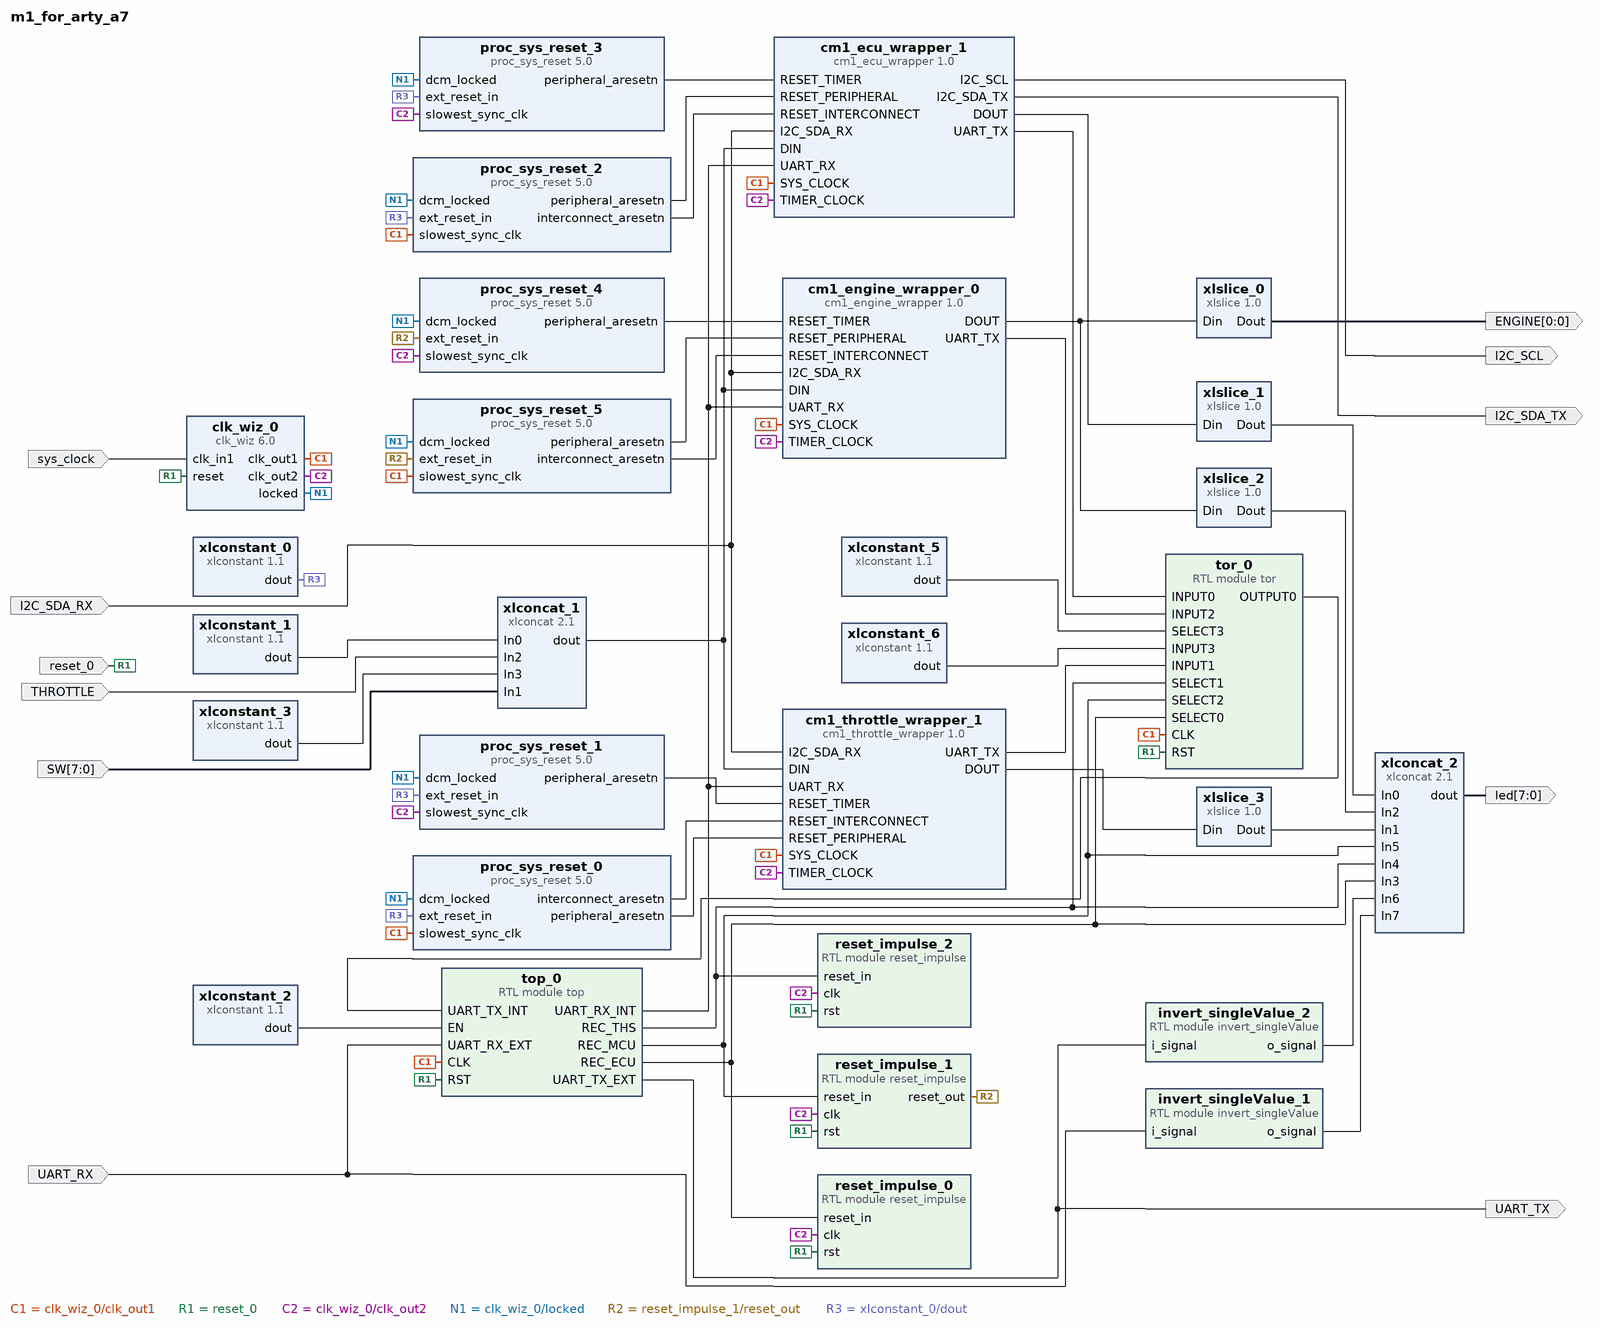
[diagram p0: block diagram of the top level]
# Vivado block design m1_for_arty_a7, xc7z020clg484-1, Vivado 2018.3
create_bd_design m1_for_arty_a7

create_bd_port -dir I -type rst reset_0
set_property -dict {CONFIG.POLARITY ACTIVE_HIGH} [get_bd_ports reset_0]
create_bd_port -dir I UART_RX
create_bd_port -dir I -type clk sys_clock
set_property -dict {CONFIG.FREQ_HZ 100000000 CONFIG.PHASE 0.000} [get_bd_ports sys_clock]
create_bd_port -dir O UART_TX
create_bd_port -dir I I2C_SDA_RX
create_bd_port -dir I THROTTLE
create_bd_port -dir O -from 7 -to 0 led
create_bd_port -dir O I2C_SDA_TX
create_bd_port -dir O I2C_SCL
create_bd_port -dir O -from 0 -to 0 ENGINE
create_bd_port -dir I -from 7 -to 0 SW

create_bd_cell -type ip -vlnv xilinx.com:ip:clk_wiz:6.0 clk_wiz_0
set_property -dict [list \
  CONFIG.CLKOUT1_JITTER 130.958 \
  CONFIG.CLKOUT1_REQUESTED_OUT_FREQ 100 \
  CONFIG.CLKOUT2_JITTER 218.754 \
  CONFIG.CLKOUT2_PHASE_ERROR 98.575 \
  CONFIG.CLKOUT2_REQUESTED_OUT_FREQ 8.000 \
  CONFIG.CLKOUT2_USED true \
  CONFIG.CLK_IN1_BOARD_INTERFACE sys_clock \
  CONFIG.MMCM_CLKOUT0_DIVIDE_F 10.000 \
  CONFIG.MMCM_CLKOUT1_DIVIDE 125 \
  CONFIG.MMCM_DIVCLK_DIVIDE 1 \
  CONFIG.NUM_OUT_CLKS 2 \
  CONFIG.USE_RESET true \
] [get_bd_cells clk_wiz_0]
create_bd_cell -type ip -vlnv xilinx.com:ip:proc_sys_reset:5.0 proc_sys_reset_0
set_property -dict {CONFIG.C_EXT_RST_WIDTH 1} [get_bd_cells proc_sys_reset_0]
create_bd_cell -type ip -vlnv xilinx.com:ip:proc_sys_reset:5.0 proc_sys_reset_1
set_property -dict {CONFIG.C_EXT_RST_WIDTH 1} [get_bd_cells proc_sys_reset_1]
create_bd_cell -type ip -vlnv xilinx.com:ip:xlconstant:1.1 xlconstant_2
set_property -dict {CONFIG.CONST_VAL 1 CONFIG.CONST_WIDTH 1} [get_bd_cells xlconstant_2]
create_bd_cell -type ip -vlnv xilinx.com:ip:xlconcat:2.1 xlconcat_1
set_property -dict [list \
  CONFIG.IN0_WIDTH 8 \
  CONFIG.IN1_WIDTH 8 \
  CONFIG.IN2_WIDTH 1 \
  CONFIG.IN3_WIDTH 15 \
  CONFIG.NUM_PORTS 4 \
] [get_bd_cells xlconcat_1]
create_bd_cell -type ip -vlnv xilinx.com:ip:xlconstant:1.1 xlconstant_1
set_property -dict {CONFIG.CONST_WIDTH 8} [get_bd_cells xlconstant_1]
create_bd_cell -type ip -vlnv xilinx.com:ip:xlslice:1.0 xlslice_0
set_property -dict {CONFIG.DIN_FROM 1 CONFIG.DIN_TO 1 CONFIG.DOUT_WIDTH 1} [get_bd_cells xlslice_0]
create_bd_cell -type ip -vlnv xilinx.com:ip:xlslice:1.0 xlslice_1
set_property -dict {CONFIG.DIN_FROM 0 CONFIG.DOUT_WIDTH 1} [get_bd_cells xlslice_1]
create_bd_cell -type ip -vlnv xilinx.com:ip:xlconstant:1.1 xlconstant_3
set_property -dict {CONFIG.CONST_WIDTH 15} [get_bd_cells xlconstant_3]
create_bd_cell -type ip -vlnv xilinx.com:ip:xlslice:1.0 xlslice_2
set_property -dict {CONFIG.DIN_FROM 0 CONFIG.DOUT_WIDTH 1} [get_bd_cells xlslice_2]
create_bd_cell -type ip -vlnv xilinx.com:ip:xlconcat:2.1 xlconcat_2
set_property -dict {CONFIG.IN0_WIDTH 1 CONFIG.NUM_PORTS 8} [get_bd_cells xlconcat_2]
create_bd_cell -type ip -vlnv xilinx.com:ip:xlslice:1.0 xlslice_3
set_property -dict {CONFIG.DIN_FROM 0 CONFIG.DOUT_WIDTH 1} [get_bd_cells xlslice_3]
create_bd_cell -type ip -vlnv xilinx.com:ip:xlconstant:1.1 xlconstant_5
set_property -dict {CONFIG.CONST_VAL 0 CONFIG.CONST_WIDTH 1} [get_bd_cells xlconstant_5]
create_bd_cell -type ip -vlnv xilinx.com:ip:proc_sys_reset:5.0 proc_sys_reset_2
set_property -dict {CONFIG.C_EXT_RST_WIDTH 1} [get_bd_cells proc_sys_reset_2]
create_bd_cell -type ip -vlnv xilinx.com:ip:proc_sys_reset:5.0 proc_sys_reset_3
set_property -dict {CONFIG.C_EXT_RST_WIDTH 1} [get_bd_cells proc_sys_reset_3]
create_bd_cell -type ip -vlnv xilinx.com:ip:proc_sys_reset:5.0 proc_sys_reset_4
set_property -dict {CONFIG.C_EXT_RST_WIDTH 1} [get_bd_cells proc_sys_reset_4]
create_bd_cell -type ip -vlnv xilinx.com:ip:proc_sys_reset:5.0 proc_sys_reset_5
set_property -dict {CONFIG.C_EXT_RST_WIDTH 1} [get_bd_cells proc_sys_reset_5]
create_bd_cell -type ip -vlnv xilinx.com:ip:xlconstant:1.1 xlconstant_6
set_property -dict {CONFIG.CONST_VAL 0 CONFIG.CONST_WIDTH 1} [get_bd_cells xlconstant_6]
create_bd_cell -type module -reference reset_impulse reset_impulse_0
create_bd_cell -type module -reference reset_impulse reset_impulse_1
create_bd_cell -type module -reference reset_impulse reset_impulse_2
create_bd_cell -type module -reference top top_0
create_bd_cell -type module -reference invert_singleValue invert_singleValue_1
create_bd_cell -type module -reference invert_singleValue invert_singleValue_2
create_bd_cell -type module -reference tor tor_0
create_bd_cell -type ip -vlnv user.org:user:cm1_ecu_wrapper:1.0 cm1_ecu_wrapper_1
create_bd_cell -type ip -vlnv user.org:user:cm1_engine_wrapper:1.0 cm1_engine_wrapper_0
create_bd_cell -type ip -vlnv user.org:user:cm1_throttle_wrapper:1.0 cm1_throttle_wrapper_1
create_bd_cell -type ip -vlnv xilinx.com:ip:xlconstant:1.1 xlconstant_0

# ---- connections ----

connect_bd_net [get_bd_pins clk_wiz_0/clk_out1] \
  [get_bd_pins proc_sys_reset_0/slowest_sync_clk] [get_bd_pins proc_sys_reset_5/slowest_sync_clk] \
  [get_bd_pins proc_sys_reset_2/slowest_sync_clk] [get_bd_pins top_0/CLK] [get_bd_pins tor_0/CLK] \
  [get_bd_pins cm1_throttle_wrapper_1/SYS_CLOCK] [get_bd_pins cm1_engine_wrapper_0/SYS_CLOCK] \
  [get_bd_pins cm1_ecu_wrapper_1/SYS_CLOCK]
connect_bd_net -net reset_0_1 [get_bd_pins proc_sys_reset_1/peripheral_aresetn] [get_bd_pins cm1_throttle_wrapper_1/RESET_TIMER]
connect_bd_net -net reset_0_2 [get_bd_ports reset_0] \
  [get_bd_pins clk_wiz_0/reset] [get_bd_pins reset_impulse_0/rst] [get_bd_pins reset_impulse_1/rst] \
  [get_bd_pins reset_impulse_2/rst] [get_bd_pins top_0/RST] [get_bd_pins tor_0/RST]
connect_bd_net -net M04_ACLK_1 [get_bd_pins clk_wiz_0/clk_out2] \
  [get_bd_pins proc_sys_reset_1/slowest_sync_clk] [get_bd_pins proc_sys_reset_4/slowest_sync_clk] \
  [get_bd_pins proc_sys_reset_3/slowest_sync_clk] [get_bd_pins reset_impulse_0/clk] [get_bd_pins reset_impulse_1/clk] \
  [get_bd_pins reset_impulse_2/clk] [get_bd_pins cm1_throttle_wrapper_1/TIMER_CLOCK] \
  [get_bd_pins cm1_engine_wrapper_0/TIMER_CLOCK] [get_bd_pins cm1_ecu_wrapper_1/TIMER_CLOCK]
connect_bd_net [get_bd_ports sys_clock] [get_bd_pins clk_wiz_0/clk_in1]
connect_bd_net [get_bd_pins clk_wiz_0/locked] \
  [get_bd_pins proc_sys_reset_0/dcm_locked] [get_bd_pins proc_sys_reset_1/dcm_locked] \
  [get_bd_pins proc_sys_reset_4/dcm_locked] [get_bd_pins proc_sys_reset_5/dcm_locked] \
  [get_bd_pins proc_sys_reset_3/dcm_locked] [get_bd_pins proc_sys_reset_2/dcm_locked]
connect_bd_net [get_bd_pins xlslice_0/Dout] [get_bd_ports ENGINE]
connect_bd_net [get_bd_pins xlconstant_1/dout] [get_bd_pins xlconcat_1/In0]
connect_bd_net [get_bd_ports THROTTLE] [get_bd_pins xlconcat_1/In2]
connect_bd_net [get_bd_ports SW] [get_bd_pins xlconcat_1/In1]
connect_bd_net [get_bd_pins xlconstant_3/dout] [get_bd_pins xlconcat_1/In3]
connect_bd_net [get_bd_pins xlconcat_1/dout] \
  [get_bd_pins cm1_throttle_wrapper_1/DIN] [get_bd_pins cm1_engine_wrapper_0/DIN] [get_bd_pins cm1_ecu_wrapper_1/DIN]
connect_bd_net [get_bd_ports I2C_SDA_RX] \
  [get_bd_pins cm1_throttle_wrapper_1/I2C_SDA_RX] [get_bd_pins cm1_engine_wrapper_0/I2C_SDA_RX] \
  [get_bd_pins cm1_ecu_wrapper_1/I2C_SDA_RX]
connect_bd_net [get_bd_pins proc_sys_reset_0/interconnect_aresetn] [get_bd_pins cm1_throttle_wrapper_1/RESET_INTERCONNECT]
connect_bd_net [get_bd_pins proc_sys_reset_0/peripheral_aresetn] [get_bd_pins cm1_throttle_wrapper_1/RESET_PERIPHERAL]
connect_bd_net [get_bd_pins top_0/UART_RX_INT] \
  [get_bd_pins cm1_throttle_wrapper_1/UART_RX] [get_bd_pins cm1_engine_wrapper_0/UART_RX] \
  [get_bd_pins cm1_ecu_wrapper_1/UART_RX]
connect_bd_net [get_bd_pins xlslice_1/Dout] [get_bd_pins xlconcat_2/In0]
connect_bd_net [get_bd_pins cm1_engine_wrapper_0/DOUT] [get_bd_pins xlslice_2/Din] [get_bd_pins xlslice_0/Din]
connect_bd_net [get_bd_pins xlconcat_2/dout] [get_bd_ports led]
connect_bd_net [get_bd_pins xlslice_3/Dout] [get_bd_pins xlconcat_2/In1]
connect_bd_net [get_bd_pins xlslice_2/Dout] [get_bd_pins xlconcat_2/In2]
connect_bd_net [get_bd_pins xlconstant_2/dout] [get_bd_pins top_0/EN]
connect_bd_net [get_bd_ports UART_RX] [get_bd_pins top_0/UART_RX_EXT] [get_bd_pins invert_singleValue_1/i_signal]
connect_bd_net [get_bd_pins top_0/REC_MCU] [get_bd_pins xlconcat_2/In5] [get_bd_pins reset_impulse_1/reset_in] [get_bd_pins tor_0/SELECT2]
connect_bd_net [get_bd_pins top_0/REC_THS] [get_bd_pins xlconcat_2/In4] [get_bd_pins reset_impulse_2/reset_in] [get_bd_pins tor_0/SELECT1]
connect_bd_net [get_bd_pins invert_singleValue_2/o_signal] [get_bd_pins xlconcat_2/In6]
connect_bd_net [get_bd_pins invert_singleValue_1/o_signal] [get_bd_pins xlconcat_2/In7]
connect_bd_net [get_bd_pins top_0/UART_TX_EXT] [get_bd_ports UART_TX] [get_bd_pins invert_singleValue_2/i_signal]
connect_bd_net [get_bd_pins top_0/REC_ECU] [get_bd_pins xlconcat_2/In3] [get_bd_pins reset_impulse_0/reset_in] [get_bd_pins tor_0/SELECT0]
connect_bd_net [get_bd_pins xlconstant_5/dout] [get_bd_pins tor_0/SELECT3]
connect_bd_net [get_bd_pins tor_0/OUTPUT0] [get_bd_pins top_0/UART_TX_INT]
connect_bd_net -net invert_singleValue_5_o_signal [get_bd_pins reset_impulse_1/reset_out] \
  [get_bd_pins proc_sys_reset_5/ext_reset_in] [get_bd_pins proc_sys_reset_4/ext_reset_in]
connect_bd_net [get_bd_pins proc_sys_reset_3/peripheral_aresetn] [get_bd_pins cm1_ecu_wrapper_1/RESET_TIMER]
connect_bd_net [get_bd_pins proc_sys_reset_2/peripheral_aresetn] [get_bd_pins cm1_ecu_wrapper_1/RESET_PERIPHERAL]
connect_bd_net [get_bd_pins proc_sys_reset_2/interconnect_aresetn] [get_bd_pins cm1_ecu_wrapper_1/RESET_INTERCONNECT]
connect_bd_net [get_bd_pins xlconstant_6/dout] [get_bd_pins tor_0/INPUT3]
connect_bd_net [get_bd_pins proc_sys_reset_4/peripheral_aresetn] [get_bd_pins cm1_engine_wrapper_0/RESET_TIMER]
connect_bd_net [get_bd_pins proc_sys_reset_5/peripheral_aresetn] [get_bd_pins cm1_engine_wrapper_0/RESET_PERIPHERAL]
connect_bd_net [get_bd_pins proc_sys_reset_5/interconnect_aresetn] [get_bd_pins cm1_engine_wrapper_0/RESET_INTERCONNECT]
connect_bd_net [get_bd_pins cm1_throttle_wrapper_1/DOUT] [get_bd_pins xlslice_3/Din]
connect_bd_net [get_bd_pins cm1_throttle_wrapper_1/UART_TX] [get_bd_pins tor_0/INPUT1]
connect_bd_net [get_bd_pins cm1_engine_wrapper_0/UART_TX] [get_bd_pins tor_0/INPUT2]
connect_bd_net [get_bd_pins cm1_ecu_wrapper_1/DOUT] [get_bd_pins xlslice_1/Din]
connect_bd_net [get_bd_pins cm1_ecu_wrapper_1/I2C_SCL] [get_bd_ports I2C_SCL]
connect_bd_net [get_bd_pins cm1_ecu_wrapper_1/I2C_SDA_TX] [get_bd_ports I2C_SDA_TX]
connect_bd_net [get_bd_pins cm1_ecu_wrapper_1/UART_TX] [get_bd_pins tor_0/INPUT0]
connect_bd_net [get_bd_pins xlconstant_0/dout] \
  [get_bd_pins proc_sys_reset_0/ext_reset_in] [get_bd_pins proc_sys_reset_1/ext_reset_in] \
  [get_bd_pins proc_sys_reset_3/ext_reset_in] [get_bd_pins proc_sys_reset_2/ext_reset_in]

validate_bd_design
save_bd_design
